# EAGLE design master_hub (EAGLE 5.11)
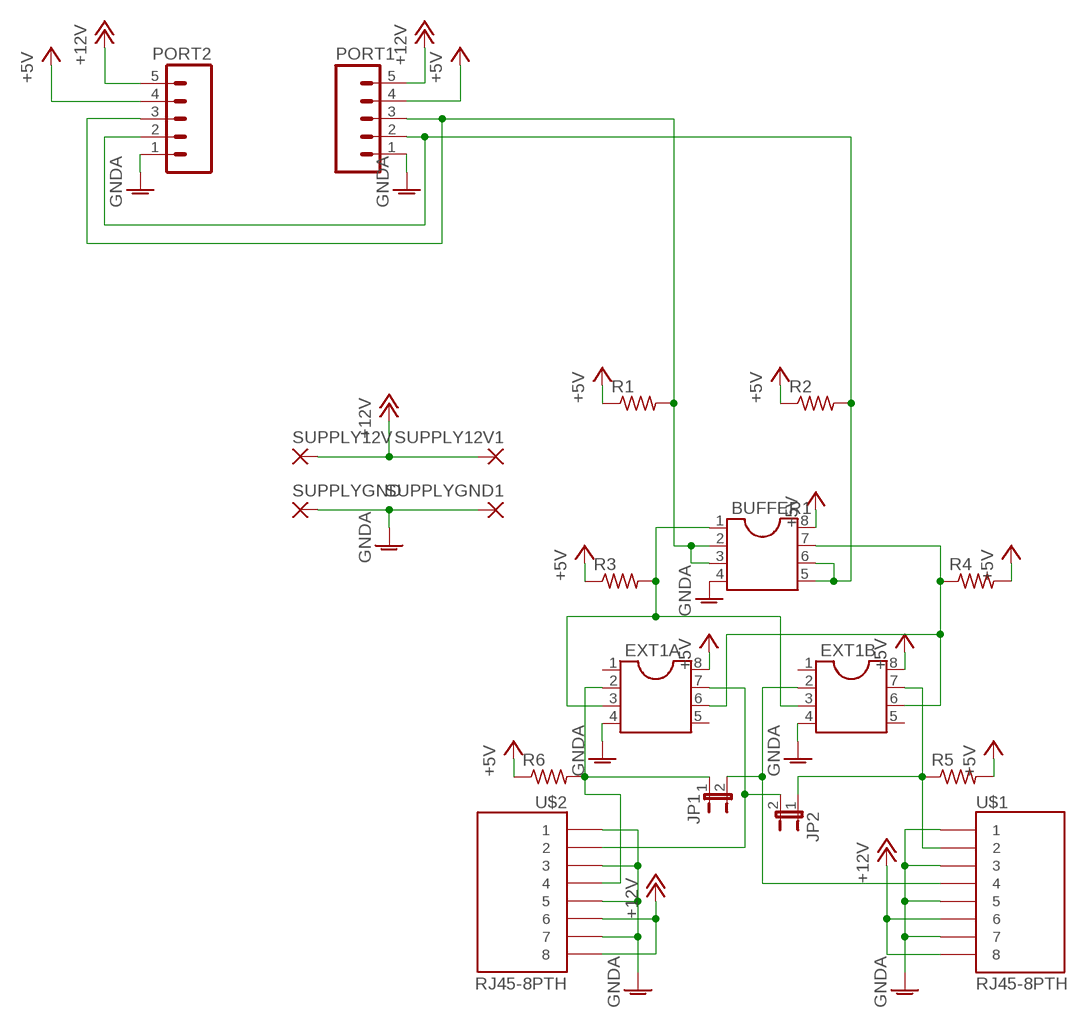
[diagram p0: schematic, sheet 1]

## Parts
BUFFER1  DIL8  [DIL08]
EXT1A  DIL8  [DIL08]
EXT1B  DIL8  [DIL08]
JP1  JUMPER-2PTH_LOCK  [1X02_LOCK]
JP2  JUMPER-2PTH_LOCK  [1X02_LOCK]
PORT1  M05LOCK  [1X05_LOCK]
PORT2  M05LOCK  [1X05_LOCK]
R1  R-US_0204/2V  [0204V]
R2  R-US_0204/2V  [0204V]
R3  R-US_0204/2V  [0204V]
R4  R-US_0204/2V  [0204V]
R5  R-US_0204/2V  [0204V]
R6  R-US_0204/2V  [0204V]
SUPPLY12V  3,81/1,4  [3,81/1,4]
SUPPLY12V1  3,81/1,4  [3,81/1,4]
SUPPLYGND  3,81/1,4  [3,81/1,4]
SUPPLYGND1  3,81/1,4  [3,81/1,4]
U$1  RJ45-8PTH  [RJ45-8]
U$2  RJ45-8PTH  [RJ45-8]

## Nets
+5V: BUFFER1.8 EXT1A.8 EXT1B.8 PORT1.4 PORT2.4 R1.1 R2.1 R3.1 R4.2 R5.2 R6.1
+12V: PORT1.5 PORT2.5 SUPPLY12V1.1(P) SUPPLY12V.1(P) U$1.6 U$1.8 U$2.6 U$2.8
GNDA: BUFFER1.4 EXT1A.4 EXT1B.4 PORT1.1 PORT2.1 SUPPLYGND1.1(P) SUPPLYGND.1(P) U$1.1 U$1.3 U$1.5 U$1.7 U$2.1 U$2.3 U$2.5 U$2.7
N$2: BUFFER1.2 BUFFER1.3 PORT1.3 PORT2.3 R1.2
N$3: BUFFER1.7 EXT1A.6 EXT1B.6 R4.1
N$4: BUFFER1.5 BUFFER1.6 PORT1.2 PORT2.2 R2.2
N$5: BUFFER1.1 EXT1A.3 EXT1B.3 R3.2
N$7: EXT1B.7 JP2.1 R5.1 U$1.2
N$8: EXT1B.2 JP1.2 U$1.4
N$9: EXT1A.7 JP2.2 U$2.2
N$10: EXT1A.2 JP1.1 R6.2 U$2.4
Unconnected: EXT1A.1 EXT1A.5 EXT1B.1 EXT1B.5

## Library data of the parts
BUFFER1 EXT1A EXT1B = ic-package:DIL8: Dual In Line / Socket
JP1 JP2 = SparkFun:JUMPER-2: Jumper Basic 0.1" spaced jumper. Use with breakaway headers.
PORT1 PORT2 = SparkFun:M05: Header 5 Standard 5-pin 0.1" header. Use with straight break away headers (SKU : PRT-00116), right angle break away headers (PRT-00553), swiss pins (PRT-00743), machine pins (PRT-00117), and female headers (PRT-00115). Molex polarized connector foot print use with SKU : PRT-08230 with associated crimp pins and housings.
R1-R6 = rcl:R-US_: RESISTOR, American symbol
SUPPLY12V SUPPLY12V1 SUPPLYGND SUPPLYGND1 = wirepad:3,81/1,4: THROUGH-HOLE PAD
U$1 U$2 = SparkFun:RJ45-8: RJ45 Jack Simple RJ45, 8-pin connection - connector for common Cat5, Cat5e, and Cat6 Ethernet cables. Footprint not yet proven in production. Connector sku is PRT-00643; Breakout PCB sku is BOB-00716.

## Board
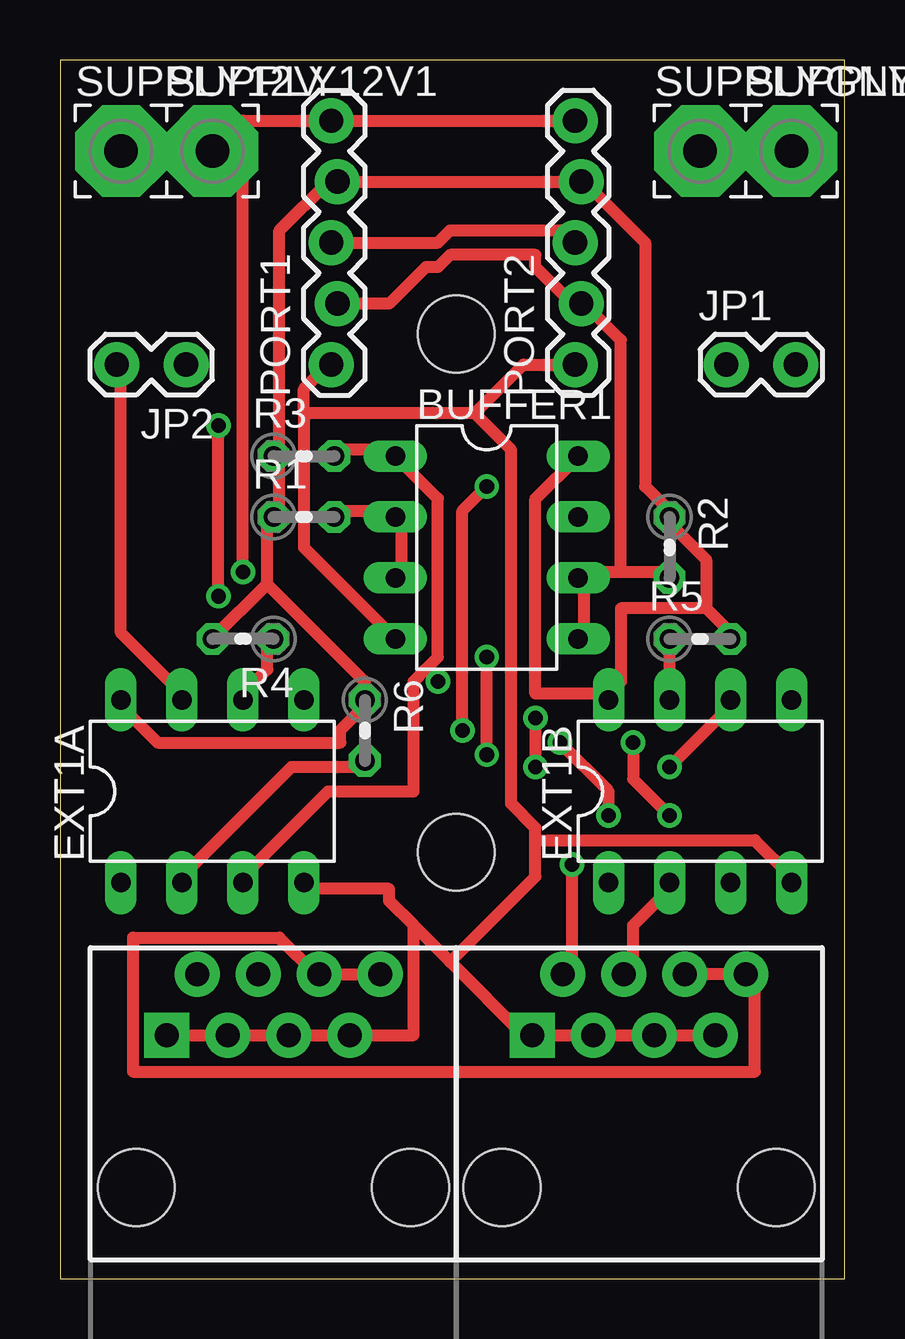
[diagram p1: board, top side]
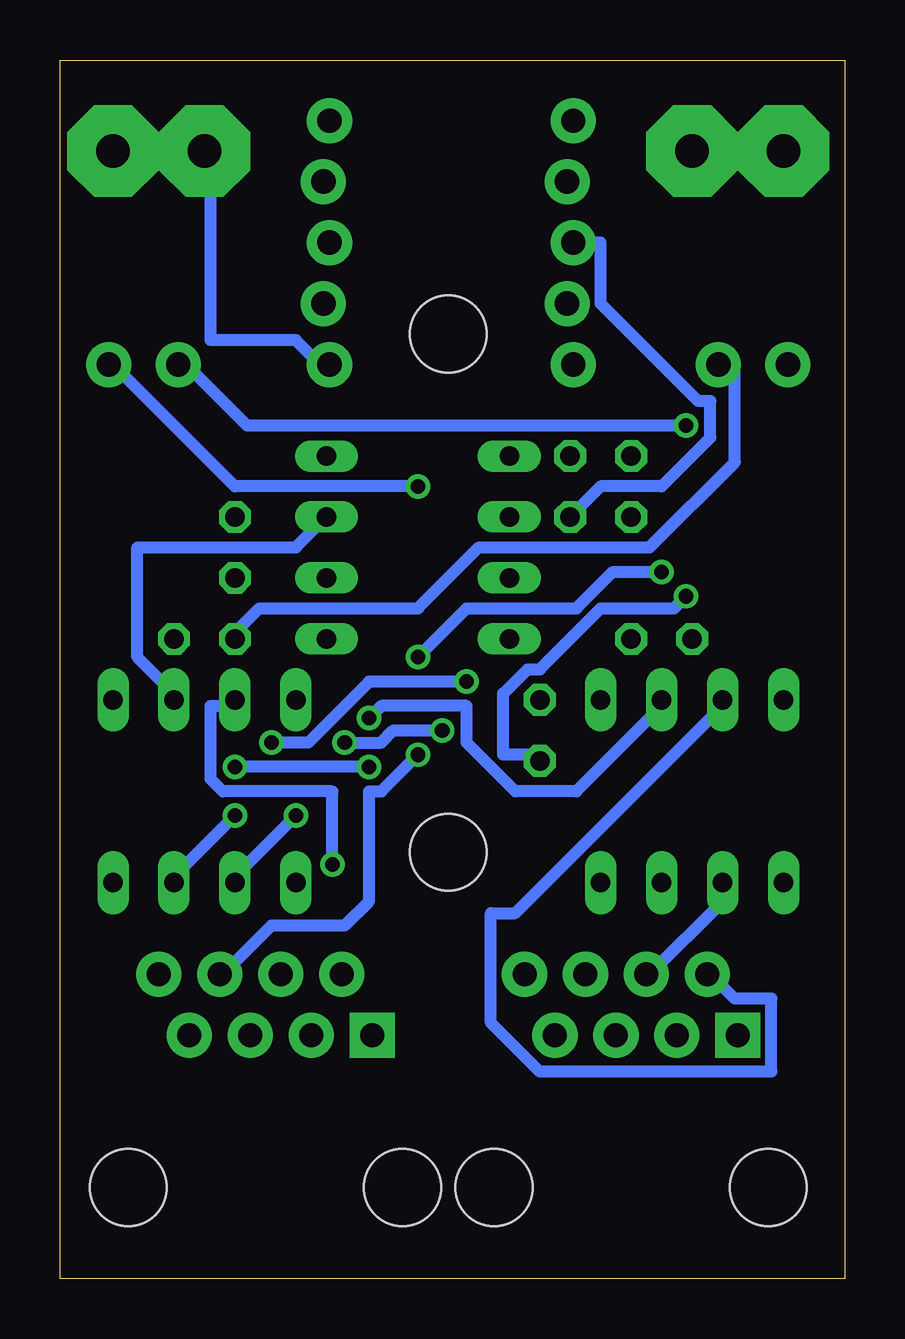
[diagram p2: board, bottom side, seen from below]

Size 32.69 x 50.79 mm. Coordinates in mm from the lower left corner, seen from the top.
Outline: 0,0 32.69,0 32.69,50.79 0,50.79 0,0
Copper layers (1*16): Top 0.035mm / dielectric 1.5mm / Bottom 0.035mm
Design rules "default *": minimum track width 20mil, minimum drill 24mil, track to track 8mil, track to pad 8mil, pad to pad 8mil, via to via 8mil, smd to smd 8mil, copper to edge 40mil, drill to drill 8mil, minimum pad ring 10mil, minimum via ring 8mil, stop-mask expansion 4mil, vias tented up to drill 0mil, thermal gap 10mil
Holes 3.2 mm at 16.51,17.78 16.51,39.37

### Footprints (pad centres in the part's own frame; a part is rotated, then mirrored left to right if it is on the bottom)
DIL08 = drill 0.813 long: 1 -3.81,-3.81; 2 -1.27,-3.81; 3 1.27,-3.81; 4 3.81,-3.81; 5 3.81,3.81; 6 1.27,3.81; 7 -1.27,3.81; 8 -3.81,3.81
1X02_LOCK = drill 1.016 pad 1.88 round: 1 -0.178,0; 2 2.718,0
1X05_LOCK = drill 1.016 pad 1.88 round: 1 0,0.127; 2 2.54,-0.127; 3 5.08,0.127; 4 7.62,-0.127; 5 10.16,0.127
0204V = drill 0.813 octagon: 1 -1.27,0; 2 1.27,0
3,81/1,4 = drill 1.397 pad 3.81 octagon: 1 0,0
RJ45-8 = drill 1 pad 1.88 square: 1 -4.445,6.35 | drill 1 pad 1.88 round: 2 -3.175,8.89; 3 -1.905,6.35; 4 -0.635,8.89; 5 0.635,6.35; 6 1.905,8.89; 7 3.175,6.35; 8 4.445,8.89 | hole 3.2: -5.715,0; 5.715,0

### Placement (x,y rotation side)
BUFFER1  17.78,30.48 270 top
EXT1A  6.35,20.32 0 top
EXT1B  26.67,20.32 0 top
JP1  27.94,38.1 0 top
JP2  5.08,38.1 180 top
PORT1  11.43,38.1 90 top
PORT2  21.59,38.1 90 top
R1  10.16,31.75 0 top
R2  25.4,30.48 270 top
R3  10.16,34.29 0 top
R4  7.62,26.67 180 top
R5  26.67,26.67 0 top
R6  12.7,22.86 270 top
SUPPLY12V  2.54,46.99 0 top
SUPPLY12V1  6.35,46.99 0 top
SUPPLYGND  26.67,46.99 0 top
SUPPLYGND1  30.48,46.99 0 top
U$1  24.13,3.81 0 top
U$2  8.89,3.81 0 top

### Tracks (layer width: path | path; a pad name or v marks a point on that pad's centre or on a via)
+5V
  Top 0.508: 26.92,27.94 27.94,26.92 R5.2 | 26.92,27.94 26.92,29.97 25.4,31.5 R2.1 25.4,32 24.38,33.02 24.38,43.18 21.84,45.72 PORT2.4 PORT1.4 11.18,45.72 9.14,43.69 9.14,34.54 R3.1 9.14,34.04 9.14,32 R1.1 8.64,31.5 8.64,28.96 | 22.86,24.38 19.81,24.38 19.81,32.51 BUFFER1.8 | 26.92,27.94 23.37,27.94 23.37,24.89 22.86,24.38 | 22.86,24.38 EXT1B.8 | 8.64,28.96 R4.2 | EXT1A.8 2.54,23.88 4.06,22.35 11.68,22.35 11.68,22.86 12.7,23.88 R6.1 12.7,24.89 8.64,28.96
+12V  (via drill 0.61)
  Top 0.508: U$2.8 U$2.6 10.67,12.7 9.14,14.22 3.05,14.22 3.05,8.64 28.96,8.64 28.96,12.7 U$1.8 U$1.6 | 7.62,48.26 6.6,48.26 6.6,47.24 SUPPLY12V1.1 | 7.62,48.26 PORT1.5 PORT2.5 | SUPPLY12V.1 2.54,47.24 6.1,47.24 SUPPLY12V1.1 | v17.78,21.84 v17.78,25.91 | v7.62,29.46 7.62,48.26 | 7.62,48.26 SUPPLY12V1.1
  Bottom 0.508: v17.78,21.84 19.3,20.32 19.81,20.32 19.81,15.75 20.83,14.73 23.88,14.73 25.91,12.7 U$1.6 | v17.78,25.91 15.75,27.94 11.18,27.94 9.65,29.46 v7.62,29.46
GNDA
  Top 0.508: 10.16,36.07 10.16,37.08 11.18,38.1 PORT1.1 | 10.16,36.07 10.16,30.48 BUFFER1.4 | 17.27,36.07 19.3,38.1 PORT2.1 | 17.27,36.07 10.16,36.07 | U$2.1 U$2.3 U$2.5 U$2.7 14.73,10.16 14.73,14.73 | U$1.7 U$1.5 U$1.3 U$1.1 19.3,10.16 16.26,13.21 | 14.73,14.73 16.26,13.21 | 14.73,14.73 13.72,15.75 13.72,16.26 10.16,16.26 EXT1A.4 | 19.81,18.29 28.96,18.29 30.48,16.76 EXT1B.4 | 19.81,18.29 19.81,16.76 16.26,13.21 | 17.27,36.07 18.8,34.54 18.8,19.81 19.81,18.8 19.81,18.29 | SUPPLYGND.1 26.92,47.24 30.48,47.24 SUPPLYGND1.1
  Bottom 0.508: SUPPLYGND.1 26.42,46.74 26.42,39.12 22.86,39.12 21.84,38.1 PORT2.1
N$2
  Top 0.508: R1.2 11.68,32 13.72,32 BUFFER1.2 14.22,31.5 14.22,29.46 BUFFER1.3 | PORT1.3 15.75,43.18 16.26,43.69 21.34,43.69 21.34,43.18 PORT2.3
  Bottom 0.508: R1.2 10.16,33.02 7.62,33.02 5.59,35.05 5.59,36.58 6.1,36.58 10.16,40.64 10.16,43.18 PORT1.3
N$3  (via drill 0.61)
  Top 0.508: EXT1A.6 7.62,24.38 8.64,25.4 8.64,26.42 R4.1 | v19.81,23.37 v19.81,21.34 | v25.4,21.34 27.94,23.88 EXT1B.6
  Bottom 0.508: EXT1B.6 27.94,24.38 29.46,25.91 29.46,30.48 22.86,30.48 BUFFER1.7 | v19.81,23.37 19.3,23.88 15.75,23.88 15.75,22.35 13.72,20.32 11.18,20.32 7.62,23.88 EXT1A.6 | v19.81,21.34 v25.4,21.34
N$4
  Top 0.508: BUFFER1.5 21.84,26.92 21.84,28.96 BUFFER1.6 21.84,29.46 23.37,29.46 | 23.37,29.46 25.4,29.46 R2.2 | PORT1.2 13.72,40.64 15.24,42.16 15.75,42.16 16.26,42.67 19.81,42.67 19.81,42.16 21.34,40.64 PORT2.2 21.84,40.64 23.37,39.12 23.37,29.46
N$5  (via drill 0.61)
  Top 0.508: 15.24,25.4 14.73,24.89 14.73,20.32 11.18,20.32 7.62,16.76 EXT1A.3 | 15.24,25.4 15.75,25.91 15.75,32.51 BUFFER1.1 13.72,34.54 11.68,34.54 R3.2 | v25.4,19.3 23.88,20.83 v23.88,22.35 | 15.24,25.4 v15.75,24.89
  Bottom 0.508: v25.4,19.3 27.94,16.76 EXT1B.3 | v23.88,22.35 22.35,22.35 19.81,24.89 v15.75,24.89
N$7  (via drill 0.61)
  Top 0.508: EXT1B.7 R5.1 | v21.34,17.27 21.34,12.7 U$1.2
  Bottom 0.508: R5.1 25.4,26.92 24.38,27.94 17.78,27.94 15.24,30.48 8.13,30.48 4.57,34.04 4.57,38.1 JP2.1 | v21.34,17.27 21.34,20.32 25.91,20.32 26.42,20.83 26.42,23.88 25.4,23.88 EXT1B.7
N$8  (via drill 0.61)
  Top 0.508: EXT1B.2 25.4,16.26 23.88,14.73 23.88,12.7 U$1.4 | v17.78,33.02 16.76,32 v16.76,22.86 | v20.83,22.35 22.86,20.32 v22.86,19.3
  Bottom 0.508: v17.78,33.02 25.4,33.02 30.48,38.1 JP1.2 | v16.76,22.86 18.8,22.86 19.3,22.35 v20.83,22.35 | v22.86,19.3 25.4,16.76 EXT1B.2
N$9
  Top 0.508: EXT1A.7 5.08,24.38 2.54,26.92 2.54,38.1 JP2.2
  Bottom 0.508: U$2.2 5.59,12.7 4.57,11.68 3.05,11.68 3.05,8.64 12.7,8.64 14.73,10.67 14.73,15.24 13.72,15.24 5.08,23.88 EXT1A.7
N$10  (via drill 0.61)
  Top 0.508: EXT1A.2 5.08,16.76 9.65,21.34 12.7,21.34 R6.2 | v6.6,28.45 v6.6,35.56
  Bottom 0.508: U$2.4 8.13,12.7 5.08,15.75 EXT1A.2 | v6.6,35.56 24.89,35.56 27.43,38.1 JP1.1 | v6.6,28.45 7.11,27.94 10.16,27.94 12.7,25.4 13.21,25.4 14.22,24.38 14.22,21.84 12.7,21.84 R6.2